# Altium project Grinemayer.PrjPcb
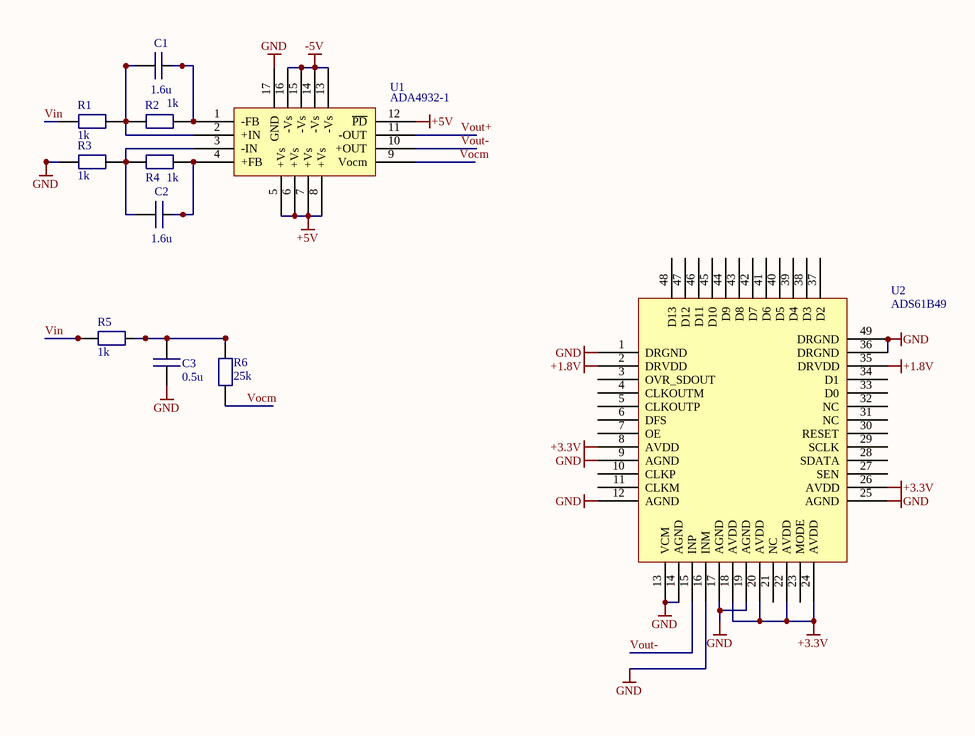
[diagram p0: Sheet1.SchDoc]
1 sheet, 11 parts. Net scope: global (net labels, ports and power ports of the same name join across sheets).
Board file: PCB1.PcbDoc

## Sheet Sheet1.SchDoc
size A

### Parts
C1  1.6u  [1608[0603]]
C2  1.6u  [1608[0603]]
C3  0.5u  [1608[0603]]
R1  1k  [1608[0603]]
R2  1k  [1608[0603]]
R3  1k  [1608[0603]]
R4  1k  [1608[0603]]
R5  1k  [1608[0603]]
R6  25k  [1608[0603]]
U1  ADA4932-1  [QFN50P300X300X100_HS-17N]
U2  ADS61B49  [QFN50P780X780X100_HS-49N]

### Nets
+1.8V: U2.2(DRVDD) U2.35(DRVDD)
+3.3V: U2.8(AVDD) U2.18(AVDD) U2.20(AVDD) U2.22(AVDD) U2.24(AVDD) U2.26(AVDD)
+5V: U1.5(+Vs) U1.6(+Vs) U1.7(+Vs) U1.8(+Vs) U1.12(~{PD})
-5V: U1.13(-Vs) U1.14(-Vs) U1.15(-Vs) U1.16(-Vs)
GND: C3.1 R3.1 U1.17(GND) U2.1(DRGND) U2.9(AGND) U2.12(AGND) U2.13(VCM) U2.14(AGND) U2.16(INM) U2.17(AGND) U2.19(AGND) U2.25(AGND) U2.36(DRGND) U2.49(DRGND)
Vin: R1.1 R5.1
Vocm: R6.1 U1.9(Vocm)
Vout+: U1.11(-OUT)
Vout-: U1.10(+OUT) U2.15(INP)
NetC1_1: C1.1 R2.2 U1.1(-FB)
NetC1_2: C1.2 R1.2 R2.1 U1.2(+IN)
NetC2_1: C2.1 R4.2 U1.4(+FB)
NetC2_2: C2.2 R3.2 R4.1 U1.3(-IN)
NetC3_2: C3.2 R5.2 R6.2

Not connected (* = marked no-connect by the designer): U2 3(OVR_SDOUT) 4(CLKOUTM) 5(CLKOUTP) 6(DFS) 7(OE) 10(CLKP) 11(CLKM) 21(NC) 23(MODE) 27(SEN) 28(SDATA) 29(SCLK) 30(RESET) 31(NC) 32(NC) 33(D0) 34(D1) 37(D2) 38(D3) 39(D4) 40(D5) 41(D6) 42(D7) 43(D8) 44(D9) 45(D10) 46(D11) 47(D12) 48(D13)

### Library data of the parts
C1-C3 = Cap
R1-R6 = Res